# EAGLE schematic 2820gpssim (EAGLE 7.3.0)
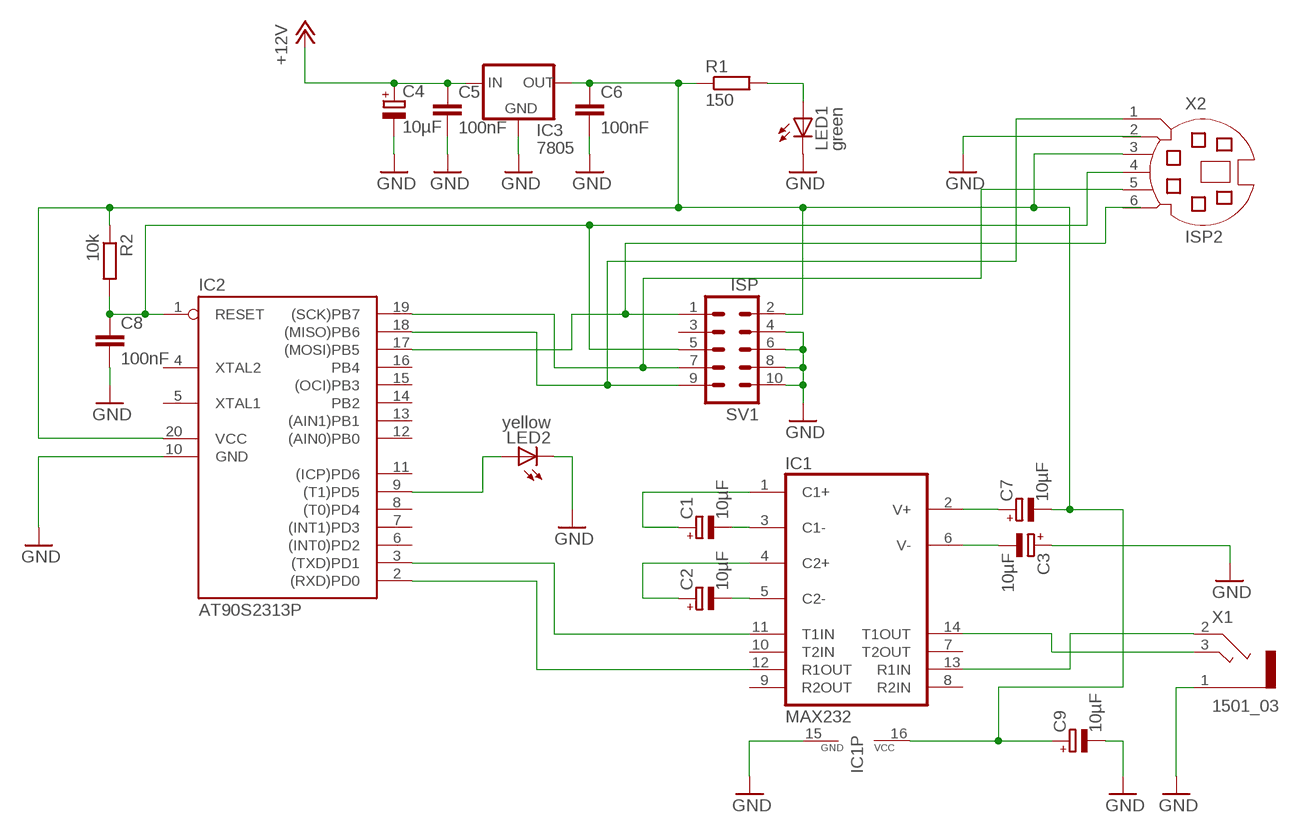
[diagram p0: schematic, sheet 1]

## Parts
C1  10µF  CPOL-EUE2.5-5  [E2,5-5]
C2  10µF  CPOL-EUE2.5-5  [E2,5-5]
C3  10µF  CPOL-EUE2.5-5  [E2,5-5]
C4  10µF  CPOL-EUE2.5-5  [E2,5-5]
C5  100nF  C-EU025-025X050  [C025-025X050]
C6  100nF  C-EU025-025X050  [C025-025X050]
C7  10µF  CPOL-EUE2.5-5  [E2,5-5]
C8  100nF  C-EU025-025X050  [C025-025X050]
C9  10µF  CPOL-EUE2.5-5  [E2,5-5]
IC1  MAX232  [DIL16]
IC2  AT90S2313P  [DIL20]
IC3  7805  78XXL  [78XXL]
LED1  green  LED3MM  [LED3MM]
LED2  yellow  LED3MM  [LED3MM]
R1  150  R-EU_0204/7  [0204/7]
R2  10k  R-EU_0204/7  [0204/7]
SV1  ISP  ML10  [ML10]
X1  1501_03  [1501_03]
X2  ISP2  MD06SS  [MDIN06SS]

## Nets
+12V: C4.+ C5.1 IC3.IN
GND: C3.+ C4.- C5.2 C6.2 C8.2 C9.- IC1.15(GND) IC2.10(GND) IC3.GND LED1.K(C) LED2.K(C) SV1.4 SV1.6 SV1.8 SV1.10 X1.1
N$1: IC1.11(T1IN) IC2.3((TXD)PD1)
N$2: IC1.12(R1OUT) IC2.2((RXD)PD0)
N$3: C2.- IC1.5(C2-)
N$4: C2.+ IC1.4(C2+)
N$5: C1.- IC1.3(C1-)
N$6: C1.+ IC1.1(C1+)
N$7: C3.- IC1.6(V-)
N$8: C6.1 C7.- C9.+ IC1.16(VCC) IC2.20(VCC) IC3.OUT R1.1 R2.1 SV1.2 X2.3
N$9: LED1.A R1.2
N$10: C7.+ IC1.2(V+)
N$11: C8.1 IC2.1(RESET) R2.2 SV1.5 X2.4
N$13: IC2.9((T1)PD5) LED2.A
N$14: IC2.19((SCK)PB7) SV1.7 X2.5
N$15: IC1.14(T1OUT) X1.3
N$17: IC2.18((MISO)PB6) SV1.9 X2.1
N$18: IC1.13(R1IN) X1.2
N$20: IC2.17((MOSI)PB5) SV1.1
Unconnected: IC1.7(T2OUT) IC1.8(R2IN) IC1.9(R2OUT) IC1.10(T2IN) IC2.4(XTAL2) IC2.5(XTAL1) IC2.6((INT0)PD2) IC2.7((INT1)PD3) IC2.8((T0)PD4) IC2.11((ICP)PD6) IC2.12((AIN0)PB0) IC2.13((AIN1)PB1) IC2.14(PB2) IC2.15((OCI)PB3) IC2.16(PB4) SV1.3 X2.2 X2.6

## Library data of the parts
C1-C4 C7 C9 = resistor:CPOL-EU: POLARIZED CAPACITOR, European symbol
C5 C6 C8 = resistor:C-EU: CAPACITOR, European symbol
IC1 = maxim:MAX232: RS232 TRANSCEIVER; MF: MAXIM; MPN: MAX232ACPE+; OC_FARNELL: 9723773; OC_NEWARK: 68K4544
IC2 = atmel:AT90S2313: MICROCONTROLLER 2 Kbytes FLASH 128 bytes SRAM 128 bytes EEPROM UART; OC_FARNELL: unknown; OC_NEWARK: unknown
IC3 = v-reg:78XXL: VOLTAGE REGULATOR
LED1 LED2 = led:LED: LED OSRAM: - CHIPLED LG R971, LG N971, LY N971, LG Q971, LY Q971, LO R971, LY R971 LH N974, LH R974 LS Q976, LO Q976, LY Q976 LO Q996 - Hyper CHIPLED LW Q18S LB Q993, LB Q99A, LB R99A - SideLED LS A670, LO A670, LY A670, LG A670, LP A670 LB A673, LV A673, LT A673, LW A673 LH A674 LY A675 LS A676, LA A676, LO A676, LY A676, LW A676 LS A679, LY A679, LG A679 - Hyper Micro SIDELED® LS Y876, LA Y876, LO Y876, LY Y876 LT Y87S - SmartLED LW L88C, LW L88S LB L89C, LB L89S, LG L890 LS L89K, LO L89K, LY L89K LS L896, LA L896, LO L896, LY L896 - TOPLED LS T670, LO T670, LY T670, LG T670, LP T670 LSG T670, LSP T670, LSY T670, LOP T670, LYG T670 LG T671, LOG T671, LSG T671 LB T673, LV T673, LT T673, LW T673 LH T674 LS T676, LA T676, LO T676, LY T676, LB T676, LH T676, LSB T676, LW T676 LB T67C, LV T67C, LT T67C, LS T67K, LO T67K, LY T67K, LW E67C LS E67B, LA E67B, LO E67B, LY E67B, LB E67C, LV E67C, LT E67C LW T67C LS T679, LY T679, LG T679 LS T770, LO T770, LY T770, LG T770, LP T770 LB T773, LV T773, LT T773, LW T773 LH T774 LS E675, LA E675, LY E675, LS T675 LS T776, LA T776, LO T776, LY T776, LB T776 LHGB T686 LT T68C, LB T68C - Hyper Mini TOPLED® LB M676 - Mini TOPLED Santana® LG M470 LS M47K, LO M47K, LY M47K Source: http://www.osram.convergy.de LUXEON: - LUMILED® LXK2-PW12-R00, LXK2-PW12-S00, LXK2-PW14-U00, LXK2-PW14-V00 LXK2-PM12-R00, LXK2-PM12-S00, LXK2-PM14-U00 LXK2-PE12-Q00, LXK2-PE12-R00, LXK2-PE12-S00, LXK2-PE14-T00, LXK2-PE14-U00 LXK2-PB12-K00, LXK2-PB12-L00, LXK2-PB12-M00, LXK2-PB14-N00, LXK2-PB14-P00, LXK2-PB14-Q00 LXK2-PR12-L00, LXK2-PR12-M00, LXK2-PR14-Q00, LXK2-PR14-R00 LXK2-PD12-Q00, LXK2-PD12-R00, LXK2-PD12-S00 LXK2-PH12-R00, LXK2-PH12-S00 LXK2-PL12-P00, LXK2-PL12-Q00, LXK2-PL12-R00 Source: www.luxeon.com KINGBRIGHT: KA-3528ASYC Source: www.kingbright.com
R1 R2 = rcl:R-EU_: RESISTOR, European symbol
SV1 = con-ml:ML10: HARTING; OC_FARNELL: unknown; OC_NEWARK: unknown
X1 = con-lumberg:1501_03: Klinkensteckverbinder nach JISC 6560, 2,5 mm Jack connectors according to JISC 6560, 2.5 mm Source: http://www.lumberg.com/Produkte/PDFs/1501_03.pdf; OC_FARNELL: 1200127; OC_NEWARK: unknown
X2 = con-yamaichi:MD06SS: YAMAICHI CONNECTOR; OC_FARNELL: unknown; OC_NEWARK: unknown